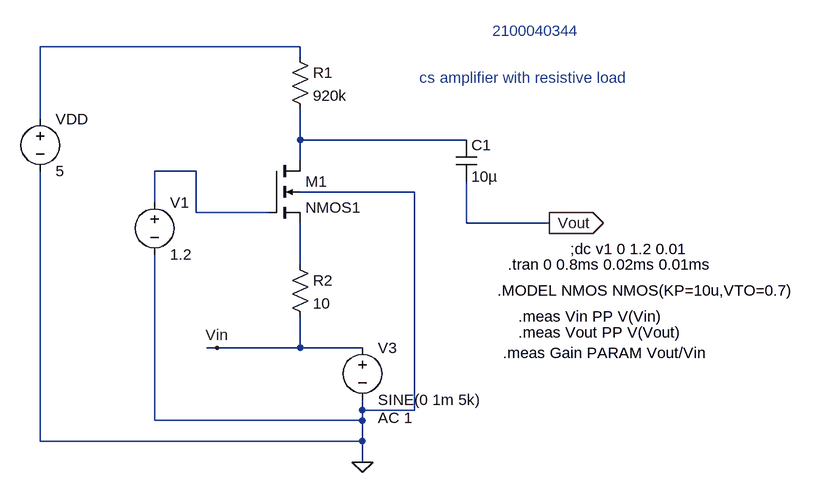
[diagram p0: schematic EXP-5 cs amp with res load.asc]
EXP-5 cs amp with res load.asc, the LTspice schematic file:
Version 4
SHEET 1 1480 680
WIRE 272 -48 -128 -48
WIRE 272 -32 272 -48
WIRE -128 64 -128 -48
WIRE 272 96 272 48
WIRE 528 96 272 96
WIRE 272 128 272 96
WIRE 112 144 48 144
WIRE 448 176 272 176
WIRE 48 192 48 144
WIRE 112 208 112 144
WIRE 224 208 112 208
WIRE 528 224 528 160
WIRE 656 224 528 224
WIRE 272 288 272 224
WIRE 144 416 128 416
WIRE 272 416 272 368
WIRE 272 416 144 416
WIRE 368 416 272 416
WIRE 368 512 368 496
WIRE 448 512 448 176
WIRE 448 512 368 512
WIRE 48 528 48 272
WIRE 368 528 368 512
WIRE 368 528 48 528
WIRE -128 560 -128 144
WIRE 368 560 368 528
WIRE 368 560 -128 560
WIRE 368 592 368 560
FLAG 368 592 0
FLAG 656 224 Vout
IOPIN 656 224 Out
FLAG 144 416 Vin
SYMBOL res 256 -48 R0
SYMATTR InstName R1
SYMATTR Value 920k
SYMBOL res 256 272 R0
SYMATTR InstName R2
SYMATTR Value 10
SYMBOL nmos4 224 128 R0
SYMATTR InstName M1
SYMATTR Value NMOS1
SYMATTR Value2 l=5u w=10u
SYMBOL voltage -128 48 R0
WINDOW 123 0 0 Left 0
WINDOW 39 0 0 Left 0
SYMATTR InstName VDD
SYMATTR Value 5
SYMBOL voltage 48 176 R0
WINDOW 123 0 0 Left 0
WINDOW 39 0 0 Left 0
SYMATTR InstName V1
SYMATTR Value 1.2
SYMBOL voltage 368 400 R0
WINDOW 123 24 124 Left 2
WINDOW 39 0 0 Left 0
SYMATTR Value2 AC 1
SYMATTR InstName V3
SYMATTR Value SINE(0 1m 5k)
SYMBOL cap 512 96 R0
SYMATTR InstName C1
SYMATTR Value 10µ
TEXT 456 0 Left 2 ;cs amplifier with resistive load
TEXT 584 424 Left 2 !.meas Gain PARAM Vout/Vin
TEXT 592 288 Left 2 !.tran 0 0.8ms 0.02ms 0.01ms
TEXT 576 328 Left 2 !.MODEL NMOS NMOS(KP=10u,VTO=0.7)
TEXT 608 368 Left 2 !.meas Vin PP V(Vin)
TEXT 608 392 Left 2 !.meas Vout PP V(Vout)
TEXT 688 264 Left 2 !;dc v1 0 1.2 0.01
TEXT 568 -72 Left 2 ;2100040344

The netlist it stands for:
* EXP-5 cs amp with res load.asc
R1 N001 N002 920k
R2 N004 Vin 10
M1 N002 N003 N004 0 NMOS1 l=5u w=10u
VDD N001 0 5
V1 N003 0 1.2
V3 Vin 0 SINE(0 1m 5k) AC 1
C1 N002 Vout 10µ
.model NMOS NMOS
.model PMOS PMOS
.lib standard.mos
* cs amplifier with resistive load
.meas Gain PARAM Vout/Vin
.tran 0 0.8ms 0.02ms 0.01ms
.MODEL NMOS NMOS(KP=10u,VTO=0.7)
.meas Vin PP V(Vin)
.meas Vout PP V(Vout)
;dc v1 0 1.2 0.01
* 2100040344
.backanno
.end